# Altium schematic sheet VALVEBOARD_DigitalPower_DigitalInterface_Controller.SchDoc
size A3; SheetNumber: 1; SheetTotal: 7
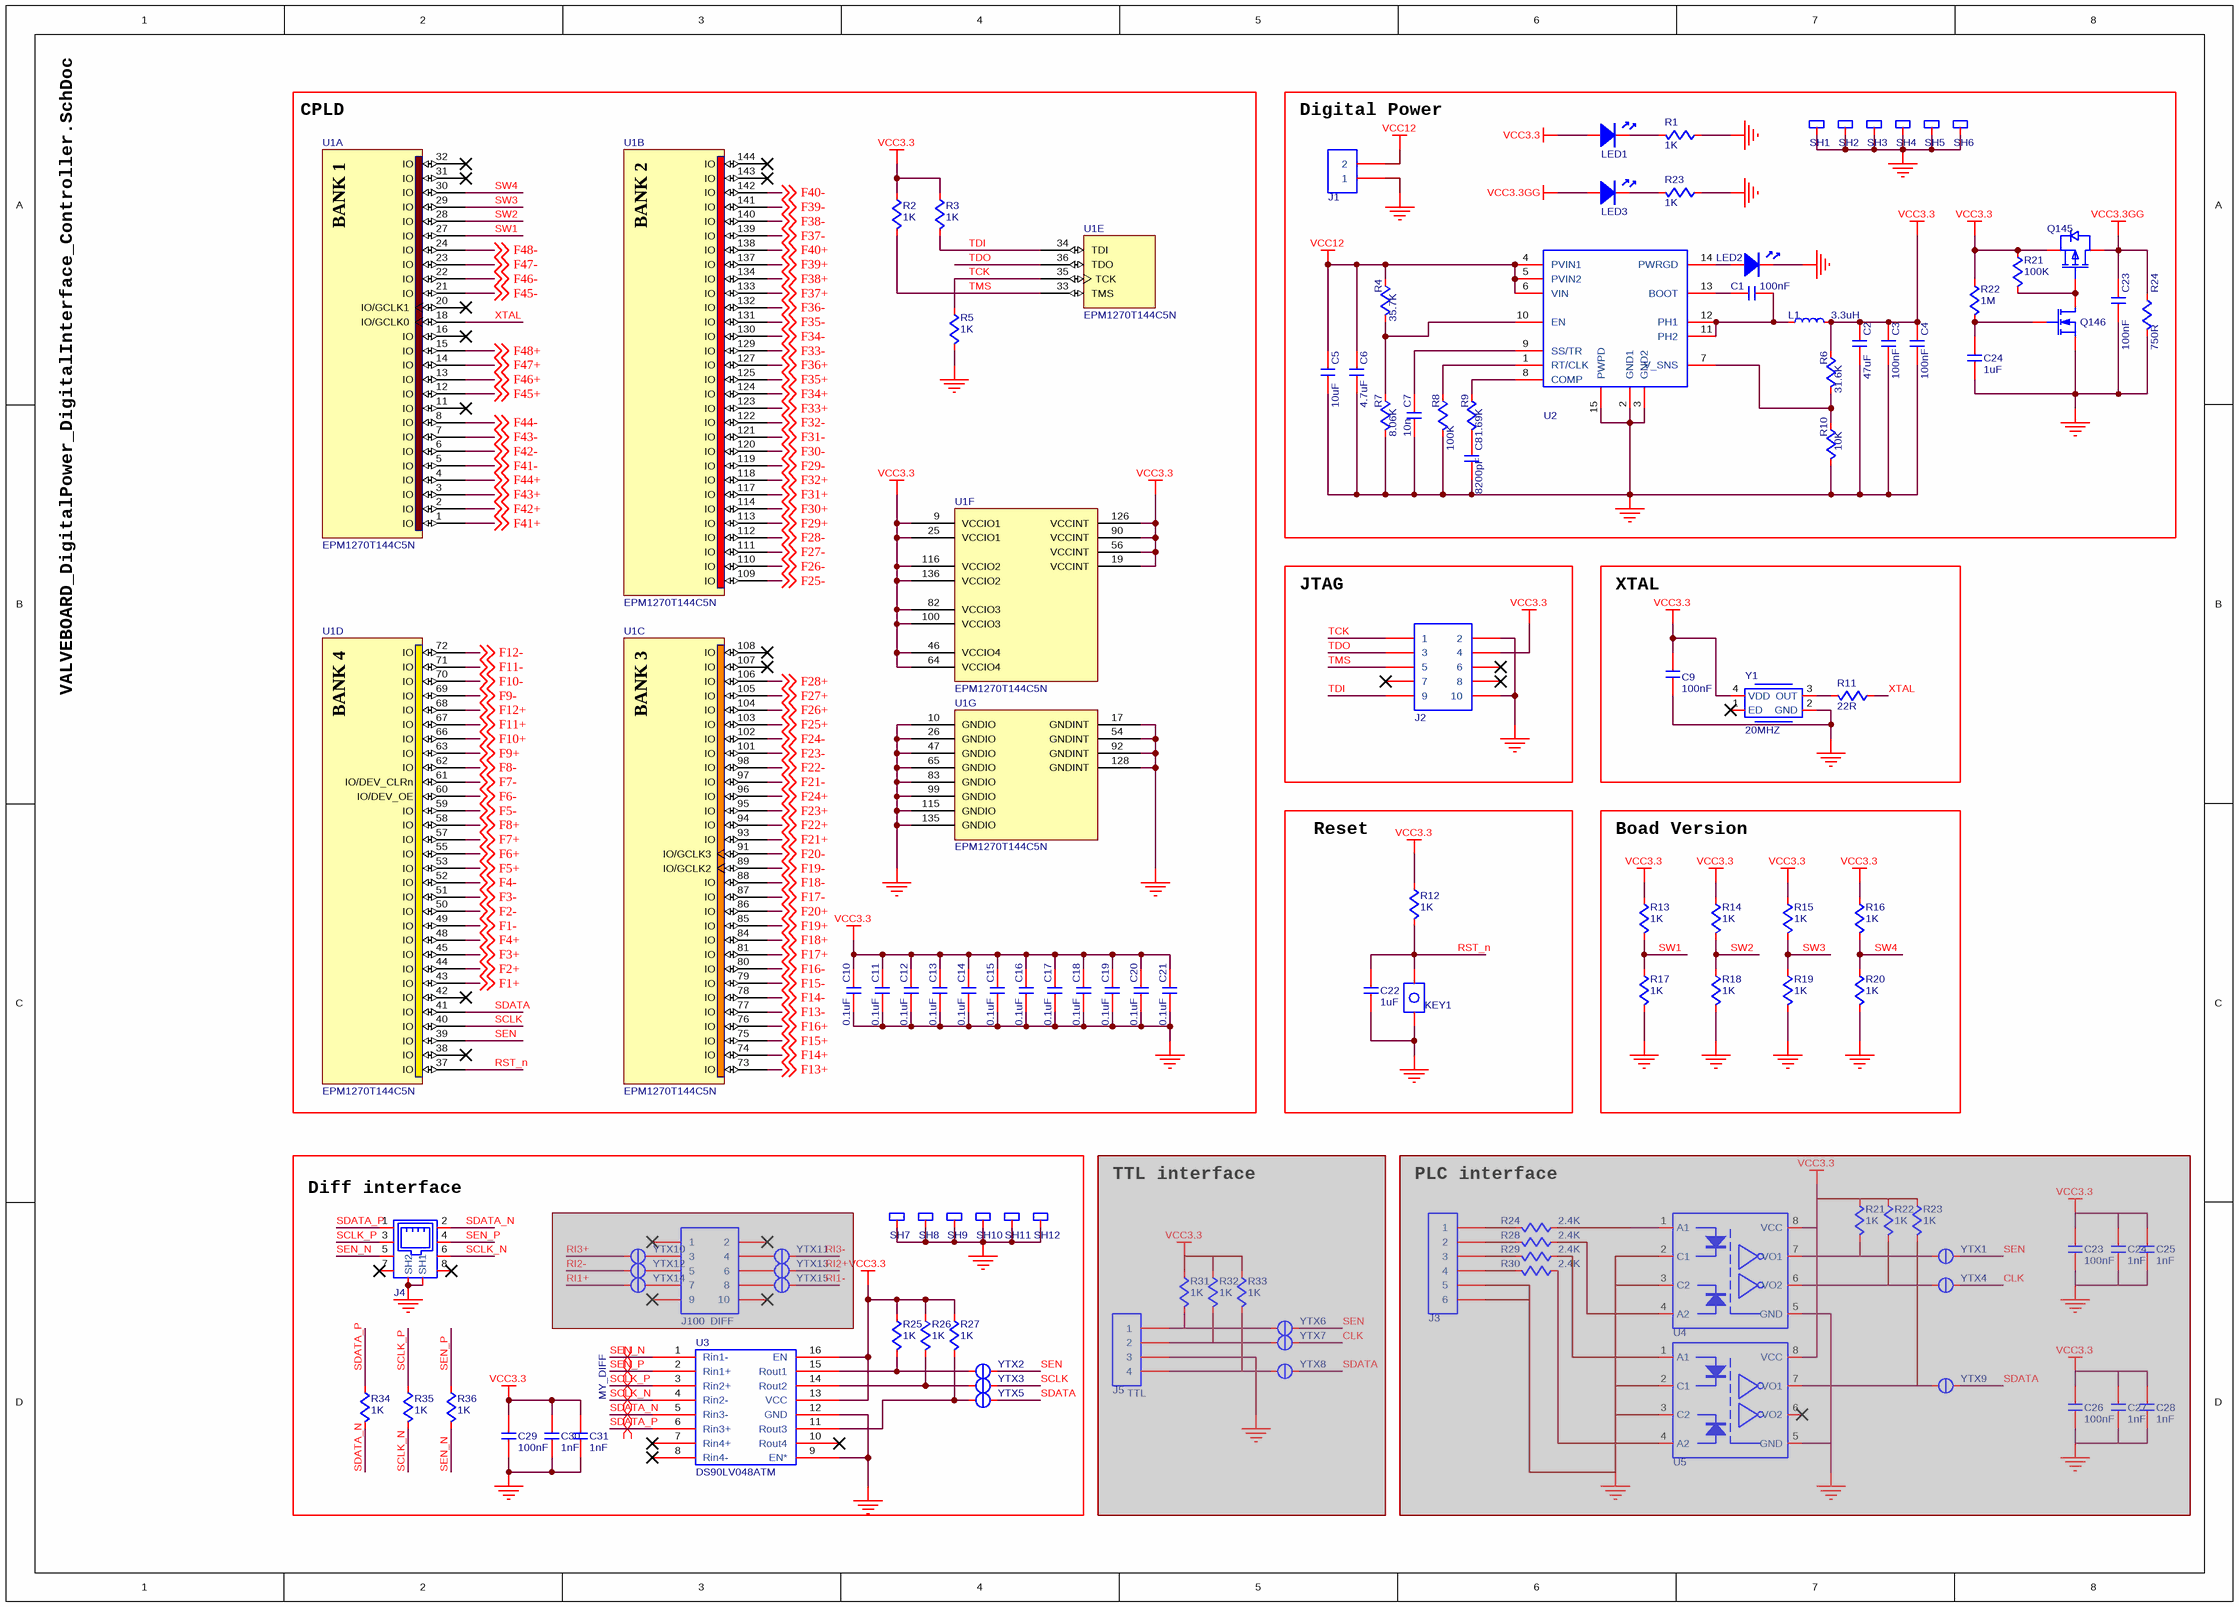
[diagram p0: VALVEBOARD_DigitalPower_DigitalInterface_Controller.SchDoc]

## Parts
(Parts that share a designator on the sheet are numbered #1, #2 ... from top to bottom, then left to right.)
C1  value 100nF  [C0402]  (hidden comment: C-NOMO)
C2  value 47uF  [C0805]  (hidden comment: C-NOMO)
C3  value 100nF  [C0402]  (hidden comment: C-NOMO)
C4  value 100nF  [C0402]  (hidden comment: C-NOMO)
C5  value 10uF  [C0805]  (hidden comment: C-NOMO)
C6  value 4.7uF  [C0805]  (hidden comment: C-NOMO)
C7  value 10n  [C0402]  (hidden comment: C-NOMO)
C8  value 8200pF  [C0402]  (hidden comment: C-NOMO)
C9  value 100nF  [C0402]  (hidden comment: C-NOMO)
C10  value 0.1uF  [C0402]  (hidden comment: C-NOMO)
C11  value 0.1uF  [C0402]  (hidden comment: C-NOMO)
C12  value 0.1uF  [C0402]  (hidden comment: C-NOMO)
C13  value 0.1uF  [C0402]  (hidden comment: C-NOMO)
C14  value 0.1uF  [C0402]  (hidden comment: C-NOMO)
C15  value 0.1uF  [C0402]  (hidden comment: C-NOMO)
C16  value 0.1uF  [C0402]  (hidden comment: C-NOMO)
C17  value 0.1uF  [C0402]  (hidden comment: C-NOMO)
C18  value 0.1uF  [C0402]  (hidden comment: C-NOMO)
C19  value 0.1uF  [C0402]  (hidden comment: C-NOMO)
C20  value 0.1uF  [C0402]  (hidden comment: C-NOMO)
C21  value 0.1uF  [C0402]  (hidden comment: C-NOMO)
C22  value 1uF  [C0402]  (hidden comment: C-NOMO)
C23#1  value 100nF  [C0402]  (hidden comment: C-NOMO)
C23#2  value 100nF  [C0402]  (hidden comment: C-NOMO)  (masked out: inside a compile mask, not in the netlist)
C24#1  value 1uF  [C0603]  (hidden comment: C-NOMO)
C24#2  value 1nF  [C0402]  (hidden comment: C-NOMO)  (masked out: inside a compile mask, not in the netlist)
C25  value 1nF  [C0402]  (hidden comment: C-NOMO)  (masked out: inside a compile mask, not in the netlist)
C26  value 100nF  [C0402]  (hidden comment: C-NOMO)  (masked out: inside a compile mask, not in the netlist)
C27  value 1nF  [C0402]  (hidden comment: C-NOMO)  (masked out: inside a compile mask, not in the netlist)
C28  value 1nF  [C0402]  (hidden comment: C-NOMO)  (masked out: inside a compile mask, not in the netlist)
C29  value 100nF  [C0402]  (hidden comment: C-NOMO)
C30  value 1nF  [C0402]  (hidden comment: C-NOMO)
C31  value 1nF  [C0402]  (hidden comment: C-NOMO)
J1  HDR1X2  [KF301-5.0-2P]  (value not drawn)
J2  HDR2X5  [HDR2X5-NJ]  (value not drawn)
J3  HDR1X6  [KF301-5.0-6P]  (value not drawn)  (masked out: inside a compile mask, not in the netlist)
J4  GE-8  [RJ45-UP]  (value not drawn)
J5  TTL  [KF301-5.0-4P]  (masked out: inside a compile mask, not in the netlist)
J100  DIFF  [HDR2X5-NJ]  (masked out: inside a compile mask, not in the netlist)
KEY1  KEY  [KEY735SO]  (value not drawn)
L1  value 3.3uH  [FXL0624]  (hidden comment: L)
LED1  LED  [LED0603]  (value not drawn)
LED2  LED  [LED0603]  (value not drawn)
LED3  LED  [LED0603]  (value not drawn)
Q145  WSD30L40DN  [WSD30L40DN]  (value not drawn)
Q146  ZVN3320F  [ZVN3320F]  (value not drawn)
R1  value 1K  [R0402]  (hidden comment: R)
R2  value 1K  [R0402]  (hidden comment: R)
R3  value 1K  [R0402]  (hidden comment: R)
R4  value 35.7K  [R0402]  (hidden comment: R)
R5  value 1K  [R0402]  (hidden comment: R)
R6  value 31.6K  [R0402]  (hidden comment: R)
R7  value 8.06K  [R0402]  (hidden comment: R)
R8  value 100K  [R0402]  (hidden comment: R)
R9  value 1.69K  [R0402]  (hidden comment: R)
R10  value 10K  [R0402]  (hidden comment: R)
R11  value 22R  [R0402]  (hidden comment: R)
R12  value 1K  [R0402]  (hidden comment: R)
R13  value 1K  [R0402]  (hidden comment: R)
R14  value 1K  [R0402]  (hidden comment: R)
R15  value 1K  [R0402]  (hidden comment: R)
R16  value 1K  [R0402]  (hidden comment: R)
R17  value 1K  [R0402]  (hidden comment: R)
R18  value 1K  [R0402]  (hidden comment: R)
R19  value 1K  [R0402]  (hidden comment: R)
R20  value 1K  [R0402]  (hidden comment: R)
R21#1  value 100K  [R0402]  (hidden comment: R)
R21#2  value 1K  [R0402]  (hidden comment: R)  (masked out: inside a compile mask, not in the netlist)
R22#1  value 1M  [R0402]  (hidden comment: R)
R22#2  value 1K  [R0402]  (hidden comment: R)  (masked out: inside a compile mask, not in the netlist)
R23#1  value 1K  [R0402]  (hidden comment: R)
R23#2  value 1K  [R0402]  (hidden comment: R)  (masked out: inside a compile mask, not in the netlist)
R24#1  value 750R  [R1812]  (hidden comment: R)
R24#2  value 2.4K  [R2512]  (hidden comment: R)  (masked out: inside a compile mask, not in the netlist)
R25  value 1K  [R0402]  (hidden comment: R)
R26  value 1K  [R0402]  (hidden comment: R)
R27  value 1K  [R0402]  (hidden comment: R)
R28  value 2.4K  [R2512]  (hidden comment: R)  (masked out: inside a compile mask, not in the netlist)
R29  value 2.4K  [R2512]  (hidden comment: R)  (masked out: inside a compile mask, not in the netlist)
R30  value 2.4K  [R2512]  (hidden comment: R)  (masked out: inside a compile mask, not in the netlist)
R31  value 1K  [R0402]  (hidden comment: R)  (masked out: inside a compile mask, not in the netlist)
R32  value 1K  [R0402]  (hidden comment: R)  (masked out: inside a compile mask, not in the netlist)
R33  value 1K  [R0402]  (hidden comment: R)  (masked out: inside a compile mask, not in the netlist)
R34  value 1K  [R0402]  (hidden comment: R)
R35  value 1K  [R0402]  (hidden comment: R)
R36  value 1K  [R0402]  (hidden comment: R)
SH1  SHIELDSUPPORT  [SHIELDSUPPORT1]  (value not drawn)
SH2  SHIELDSUPPORT  [SHIELDSUPPORT1]  (value not drawn)
SH3  SHIELDSUPPORT  [SHIELDSUPPORT1]  (value not drawn)
SH4  SHIELDSUPPORT  [SHIELDSUPPORT1]  (value not drawn)
SH5  SHIELDSUPPORT  [SHIELDSUPPORT1]  (value not drawn)
SH6  SHIELDSUPPORT  [SHIELDSUPPORT1]  (value not drawn)
SH7  SHIELDSUPPORT  [SHIELDSUPPORT1]  (value not drawn)
SH8  SHIELDSUPPORT  [SHIELDSUPPORT1]  (value not drawn)
SH9  SHIELDSUPPORT  [SHIELDSUPPORT1]  (value not drawn)
SH10  SHIELDSUPPORT  [SHIELDSUPPORT1]  (value not drawn)
SH11  SHIELDSUPPORT  [SHIELDSUPPORT1]  (value not drawn)
SH12  SHIELDSUPPORT  [SHIELDSUPPORT1]  (value not drawn)
U1  EPM1270T144C5N  [TQFP144_N]  (parts A,B,C,D,E,F,G of 7)
U2  TPS54620  [TPS54620]  (value not drawn)
U3  DS90LV048ATM  [DS90LV048]
U4  TLP2168  [TLP2168]  (value not drawn)  (masked out: inside a compile mask, not in the netlist)
U5  TLP2168  [TLP2168]  (value not drawn)  (masked out: inside a compile mask, not in the netlist)
Y1  frequency: 20MHZ  [OSC3225]  (hidden comment: XTAL)
YTX1  YTX  [YTX]  (value not drawn)  (masked out: inside a compile mask, not in the netlist)
YTX2  YTX  [YTX]  (value not drawn)
YTX3  YTX  [YTX]  (value not drawn)
YTX4  YTX  [YTX]  (value not drawn)  (masked out: inside a compile mask, not in the netlist)
YTX5  YTX  [YTX]  (value not drawn)
YTX6  YTX  [YTX]  (value not drawn)  (masked out: inside a compile mask, not in the netlist)
YTX7  YTX  [YTX]  (value not drawn)  (masked out: inside a compile mask, not in the netlist)
YTX8  YTX  [YTX]  (value not drawn)  (masked out: inside a compile mask, not in the netlist)
YTX9  YTX  [YTX]  (value not drawn)  (masked out: inside a compile mask, not in the netlist)
YTX10  YTX  [YTX]  (value not drawn)  (masked out: inside a compile mask, not in the netlist)
YTX11  YTX  [YTX]  (value not drawn)  (masked out: inside a compile mask, not in the netlist)
YTX12  YTX  [YTX]  (value not drawn)  (masked out: inside a compile mask, not in the netlist)
YTX13  YTX  [YTX]  (value not drawn)  (masked out: inside a compile mask, not in the netlist)
YTX14  YTX  [YTX]  (value not drawn)  (masked out: inside a compile mask, not in the netlist)
YTX15  YTX  [YTX]  (value not drawn)  (masked out: inside a compile mask, not in the netlist)

## Blocks framed on the sheet
CPLD: C10-C21 R2 R3 R5 U1
Digital Power: C1-C8 C23#1 C24#1 J1 L1 LED1-LED3 Q145 Q146 R1 R4 R6-R10 R21#1 R22#1 R23#1 R24#1 SH1-SH6 U2
JTAG: J2
XTAL: C9 R11 Y1
Reset: C22 KEY1 R12
Boad Version: R13-R20
Diff interface: C29-C31 J4 J100 R25-R27 R34-R36 SH7-SH12 U3 YTX2 YTX3 YTX5 YTX10-YTX15
TTL interface: J5 R31-R33 YTX6-YTX8
PLC interface: C23#2 C24#2 C25-C28 J3 R21#2 R22#2 R23#2 R24#2 R28-R30 U4 U5 YTX1 YTX4 YTX9

## Nets
DGND: C2.1 C3.1 C4.1 C5.1 C6.1 C7.1 C8.1 C9.1 C10.1 C11.1 C12.1 C13.1 C14.1 C15.1 C16.1 C17.1 C18.1 C19.1 C20.1 C21.1 C22.1 C23#1.1 C24#1.1 C29.1 C30.1 C31.1 J1.1 J2.2 J2.10 J4.SH1 J4.SH2 KEY1.1 LED2.1 Q146.3(S) R1.2 R5.1 R7.1 R8.1 R10.1 R17.1 R18.1 R19.1 R20.1 R23#1.2 R24#1.1 SH1.SH SH2.SH SH3.SH SH4.SH SH5.SH SH6.SH SH7.SH SH8.SH SH9.SH SH10.SH SH11.SH SH12.SH U1.10(GNDIO) U1.17(GNDINT) U1.26(GNDIO) U1.47(GNDIO) U1.54(GNDINT) U1.65(GNDIO) U1.83(GNDIO) U1.92(GNDINT) U1.99(GNDIO) U1.115(GNDIO) U1.128(GNDINT) U1.135(GNDIO) U2.2(GND1) U2.3(GND2) U2.15(PWPD) U3.9(EN*) U3.12(GND) Y1.2(GND)
VCC3.3: C2.2 C3.2 C4.2 C9.2 C10.2 C11.2 C12.2 C13.2 C14.2 C15.2 C16.2 C17.2 C18.2 C19.2 C20.2 C21.2 C29.2 C30.2 C31.2 J2.4 L1.2 LED1.2 Q145.S R2.2 R3.2 R6.2 R12.2 R13.2 R14.2 R15.2 R16.2 R21#1.2 R22#1.2 R25.2 R26.2 R27.2 U1.9(VCCIO1) U1.19(VCCINT) U1.25(VCCIO1) U1.46(VCCIO4) U1.56(VCCINT) U1.64(VCCIO4) U1.82(VCCIO3) U1.90(VCCINT) U1.100(VCCIO3) U1.116(VCCIO2) U1.126(VCCINT) U1.136(VCCIO2) U3.13(VCC) U3.16(EN) Y1.4(VDD)
VCC3.3GG: C23#1.2 LED3.2 Q145.D R24#1.2
VCC12: C5.2 C6.2 J1.2 R4.2 U2.4(PVIN1) U2.5(PVIN2) U2.6(VIN)
F1+: U1.43(IO) ; off-sheet F1+
F1-: U1.49(IO) ; off-sheet F1-
F2+: U1.44(IO) ; off-sheet F2+
F2-: U1.50(IO) ; off-sheet F2-
F3+: U1.45(IO) ; off-sheet F3+
F3-: U1.51(IO) ; off-sheet F3-
F4+: U1.48(IO) ; off-sheet F4+
F4-: U1.52(IO) ; off-sheet F4-
F5+: U1.53(IO) ; off-sheet F5+
F5-: U1.59(IO) ; off-sheet F5-
F6+: U1.55(IO) ; off-sheet F6+
F6-: U1.60(IO/DEV_OE) ; off-sheet F6-
F7+: U1.57(IO) ; off-sheet F7+
F7-: U1.61(IO/DEV_CLRn) ; off-sheet F7-
F8+: U1.58(IO) ; off-sheet F8+
F8-: U1.62(IO) ; off-sheet F8-
F9+: U1.63(IO) ; off-sheet F9+
F9-: U1.69(IO) ; off-sheet F9-
F10+: U1.66(IO) ; off-sheet F10+
F10-: U1.70(IO) ; off-sheet F10-
F11+: U1.67(IO) ; off-sheet F11+
F11-: U1.71(IO) ; off-sheet F11-
F12+: U1.68(IO) ; off-sheet F12+
F12-: U1.72(IO) ; off-sheet F12-
F13+: U1.73(IO) ; off-sheet F13+
F13-: U1.77(IO) ; off-sheet F13-
F14+: U1.74(IO) ; off-sheet F14+
F14-: U1.78(IO) ; off-sheet F14-
F15+: U1.75(IO) ; off-sheet F15+
F15-: U1.79(IO) ; off-sheet F15-
F16+: U1.76(IO) ; off-sheet F16+
F16-: U1.80(IO) ; off-sheet F16-
F17+: U1.81(IO) ; off-sheet F17+
F17-: U1.87(IO) ; off-sheet F17-
F18+: U1.84(IO) ; off-sheet F18+
F18-: U1.88(IO) ; off-sheet F18-
F19+: U1.85(IO) ; off-sheet F19+
F19-: U1.89(IO/GCLK2) ; off-sheet F19-
F20+: U1.86(IO) ; off-sheet F20+
F20-: U1.91(IO/GCLK3) ; off-sheet F20-
F21+: U1.93(IO) ; off-sheet F21+
F21-: U1.97(IO) ; off-sheet F21-
F22+: U1.94(IO) ; off-sheet F22+
F22-: U1.98(IO) ; off-sheet F22-
F23+: U1.95(IO) ; off-sheet F23+
F23-: U1.101(IO) ; off-sheet F23-
F24+: U1.96(IO) ; off-sheet F24+
F24-: U1.102(IO) ; off-sheet F24-
F25+: U1.103(IO) ; off-sheet F25+
F25-: U1.109(IO) ; off-sheet F25-
F26+: U1.104(IO) ; off-sheet F26+
F26-: U1.110(IO) ; off-sheet F26-
F27+: U1.105(IO) ; off-sheet F27+
F27-: U1.111(IO) ; off-sheet F27-
F28+: U1.106(IO) ; off-sheet F28+
F28-: U1.112(IO) ; off-sheet F28-
F29+: U1.113(IO) ; off-sheet F29+
F29-: U1.119(IO) ; off-sheet F29-
F30+: U1.114(IO) ; off-sheet F30+
F30-: U1.120(IO) ; off-sheet F30-
F31+: U1.117(IO) ; off-sheet F31+
F31-: U1.121(IO) ; off-sheet F31-
F32+: U1.118(IO) ; off-sheet F32+
F32-: U1.122(IO) ; off-sheet F32-
F33+: U1.123(IO) ; off-sheet F33+
F33-: U1.129(IO) ; off-sheet F33-
F34+: U1.124(IO) ; off-sheet F34+
F34-: U1.130(IO) ; off-sheet F34-
F35+: U1.125(IO) ; off-sheet F35+
F35-: U1.131(IO) ; off-sheet F35-
F36+: U1.127(IO) ; off-sheet F36+
F36-: U1.132(IO) ; off-sheet F36-
F37+: U1.133(IO) ; off-sheet F37+
F37-: U1.139(IO) ; off-sheet F37-
F38+: U1.134(IO) ; off-sheet F38+
F38-: U1.140(IO) ; off-sheet F38-
F39+: U1.137(IO) ; off-sheet F39+
F39-: U1.141(IO) ; off-sheet F39-
F40+: U1.138(IO) ; off-sheet F40+
F40-: U1.142(IO) ; off-sheet F40-
F41+: U1.1(IO) ; off-sheet F41+
F41-: U1.5(IO) ; off-sheet F41-
F42+: U1.2(IO) ; off-sheet F42+
F42-: U1.6(IO) ; off-sheet F42-
F43+: U1.3(IO) ; off-sheet F43+
F43-: U1.7(IO) ; off-sheet F43-
F44+: U1.4(IO) ; off-sheet F44+
F44-: U1.8(IO) ; off-sheet F44-
F45+: U1.12(IO) ; off-sheet F45+
F45-: U1.21(IO) ; off-sheet F45-
F46+: U1.13(IO) ; off-sheet F46+
F46-: U1.22(IO) ; off-sheet F46-
F47+: U1.14(IO) ; off-sheet F47+
F47-: U1.23(IO) ; off-sheet F47-
F48+: U1.15(IO) ; off-sheet F48+
F48-: U1.24(IO) ; off-sheet F48-
RST_n: C22.2 KEY1.2 R12.1 U1.37(IO)
SCLK: U1.40(IO) YTX3.1
SCLK_N: J4.6 R35.1 U3.4(Rin2-)
SCLK_P: J4.3 R35.2 U3.3(Rin2+)
SDATA: U1.41(IO) YTX5.1
SDATA_N: J4.2 R34.1 U3.5(Rin3-)
SDATA_P: J4.1 R34.2 U3.6(Rin3+)
SEN: U1.39(IO) YTX2.1
SEN_N: J4.5 R36.1 U3.1(Rin1-)
SEN_P: J4.4 R36.2 U3.2(Rin1+)
SW1: R13.1 R17.2 U1.27(IO)
SW2: R14.1 R18.2 U1.28(IO)
SW3: R15.1 R19.2 U1.29(IO)
SW4: R16.1 R20.2 U1.30(IO)
TCK: J2.1 R5.2 U1.35(TCK)
TDI: J2.9 R3.1 U1.34(TDI)
TDO: J2.3 U1.36(TDO)
TMS: J2.5 R2.1 U1.33(TMS)
XTAL: R11.2 U1.18(IO/GCLK0)
NetC1_1: C1.1 U2.13(BOOT)
NetC1_2: C1.2 L1.1 U2.11(PH2) U2.12(PH1)
NetC7_2: C7.2 U2.9(SS/TR)
NetC8_2: C8.2 R9.1
NetC24#1_2: C24#1.2 Q146.2(G) R22#1.1
NetLED1_1: LED1.1 R1.1
NetLED2_2: LED2.2 U2.14(PWRGD)
NetLED3_1: LED3.1 R23#1.1
NetQ145_G: Q145.G Q146.1(D) R21#1.1
NetR4_1: R4.1 R7.2 U2.10(EN)
NetR6_1: R6.1 R10.2 U2.7(V_SNS)
NetR8_2: R8.2 U2.1(RT/CLK)
NetR9_2: R9.2 U2.8(COMP)
NetR11_1: R11.1 Y1.3(OUT)
NetR25_1: R25.1 U3.15(Rout1) YTX2.2
NetR26_1: R26.1 U3.14(Rout2) YTX3.2
NetR27_1: R27.1 U3.11(Rout3) YTX5.2

Not connected (* = marked no-connect by the designer): J2 6* 7* 8*; J4 7* 8*; U1 11(IO)* 16(IO)* 20(IO/GCLK1)* 31(IO)* 32(IO)* 38(IO)* 42(IO)* 107(IO)* 108(IO)* 143(IO)* 144(IO)*; U3 7(Rin4+)* 8(Rin4-)* 10(Rout4)*; Y1 1(ED)*

## Layout directives
differential pair; differential pair class MY_DIFF: SCLK_N, SCLK_P, SDATA_N, SDATA_P, SEN_N, SEN_P

## Notes on the sheet
- (in symbol EPM1270T144C5N, part A) BANK 1
- (in symbol EPM1270T144C5N, part B) BANK 2
- (in symbol EPM1270T144C5N, part C) BANK 3
- (in symbol EPM1270T144C5N, part D) BANK 4

## Library data of the parts
C1-C22 C23#1 C23#2 C24#1 C24#2 C25-C31 = C-NOMO: voltage: 25V; precision: 5%
J4 = RJ45-UP
J5 = HDR1X4
J100 = HDR2X5
L1 = L: Code_IEC: 1005; Published: 8-Jun-2000; LatestRevisionDate: 29-May-2009; LatestRevisionNote: IPC-7351 Footprint Added.; PackageReference: 0402-A; Publisher: Altium Limited; PackageDescription: Chip Inductor; Code_JEITA: 0402
Q146 = ZVN3320F: N-Channel MOSFET; Published: 8-Jun-2000; LatestRevisionDate: 17-Jul-2002; LatestRevisionNote: Re-released for DXP Platform.; PackageVersion: 1995/1996; PackageReference: E3; Publisher: Altium Limited; PackageDescription: TO, Flat Index; 3 In-Line, Axial Leads; Body Dia. 4.6mm; Lead Dia. 0.5 mm (max)
R1-R20 R21#1 R21#2 R22#1 R22#2 R23#1 R23#2 R24#1 R24#2 R25-R36 = R: precision: 1%
U1 = EPM1270T144C5N: MAX II 3.3/2.5V CPLD, 116 IOs, 1,270 Logic Elements, 144-Pin Plastic TQFP, Commercial Temperature, Speed Grade 5, Pb-Free; Note: All VCCINT pins must be connected to either 3.3V or 2.5V (but not a combination of both).; DatasheetVersion: ver1.8, Jul-2006; PackageVersion: ver16.3, Dec-2010; PackageReference: TQFP144; PackageDescription: 144-Pin Plastic Thin Quad Flat Pack (TQFP144) - Wire Bond; Code_JEDEC: MS-026-BFB; ComponentLink1Description: Manufacturer URL; ComponentLink1URL: http://www.altera.com/; ComponentLink2Description: Handbook; ComponentLink2URL: http://www.altera.com/literature/hb/max2/max2_mii5v1.pdf; ComponentLink3Description: Package Specification; ComponentLink3URL: http://www.altera.com/literature/ds/dspkg.pdf
Q145 = WSD30L40DN: Supplier 1: LCSC; Supplier Part Number 1: C148390